# Altium schematic sheet WL-AUDIO.SchDoc
size 420 x 297 mm; Address1: Address1; Address2: Address2; Address3: Address3; Address4: Address4; DocumentNumber: ТРАНСИВЕР «ВОЛК»; SheetNumber: 6; Scale: 1:1; DocumentType: Схема электрическая принципиальная; FirstReferrence: АБВГ.123456.001
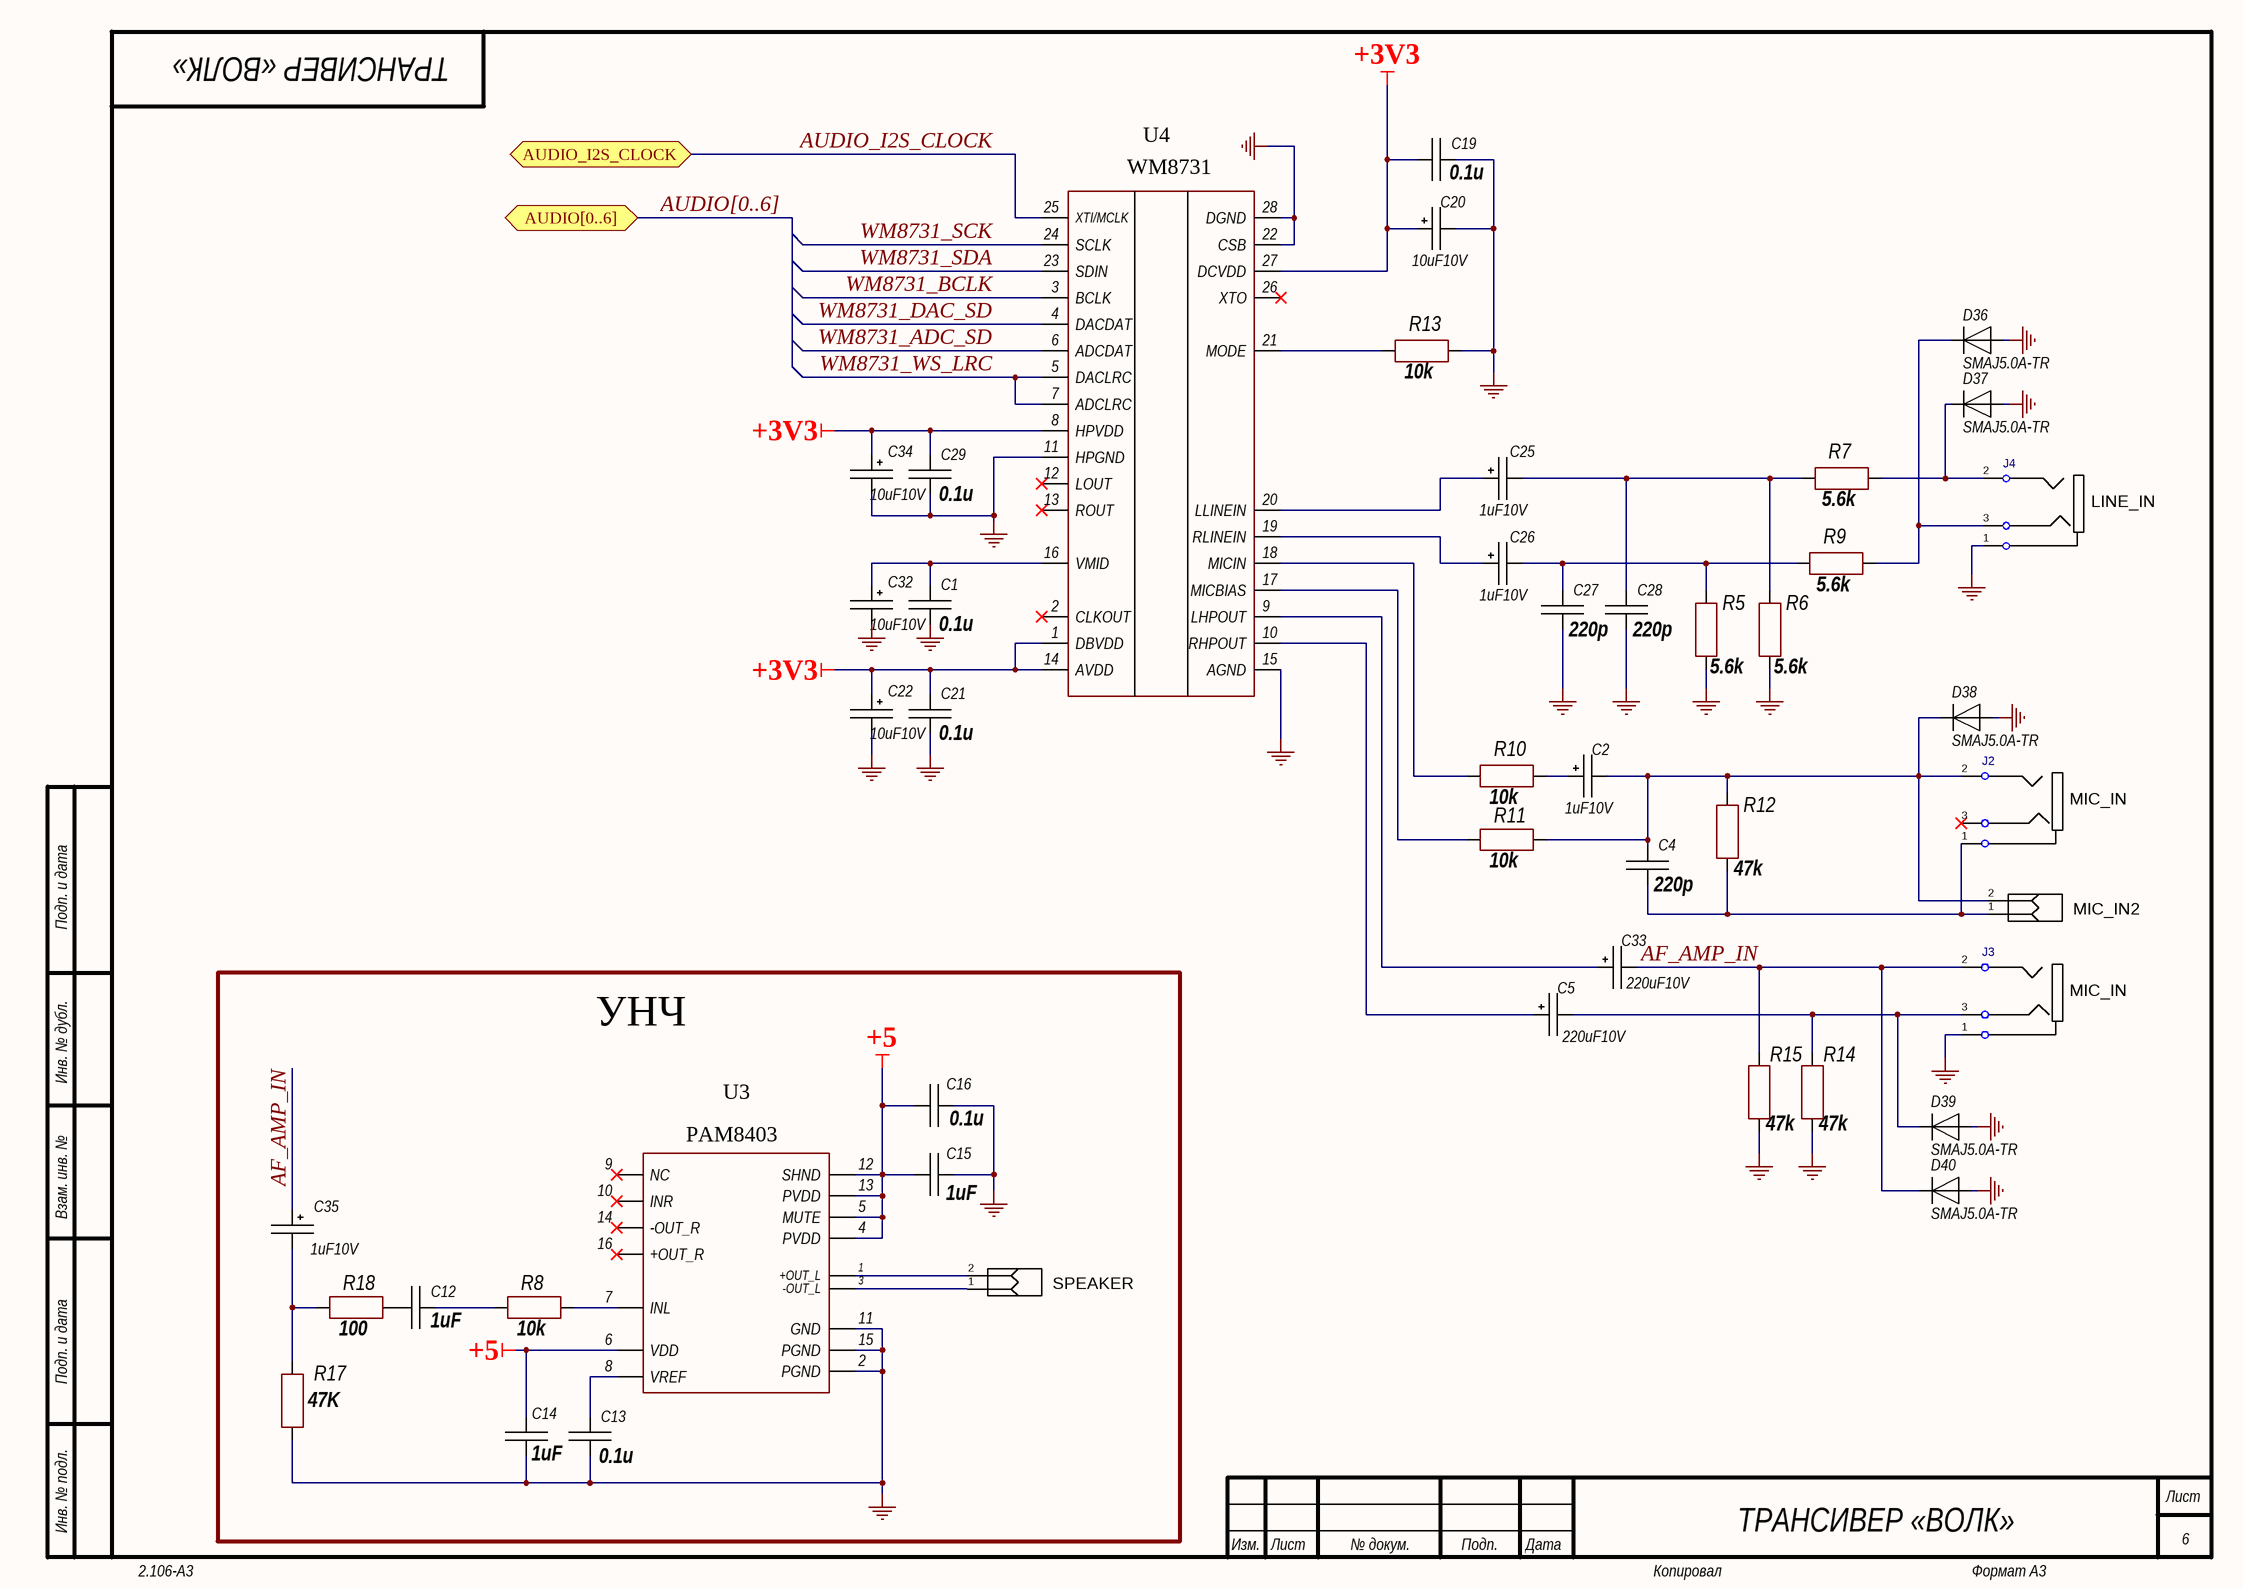
[diagram p0: WL-AUDIO.SchDoc]

## Parts
C1  0.1u  [CH0201C]
C2  1uF10V  [D5C2H11]
C4  220p  [CH0201C]
C5  220uF10V  [D5C2H11]
C12  1uF  [CH0201C]
C13  0.1u  [CH0805C]
C14  1uF  [CH0805C]
C15  1uF  [CH0805C]
C16  0.1u  [CH0805C]
C19  0.1u  [CH0201C]
C20  10uF10V  [D5C2H11]
C21  0.1u  [CH0201C]
C22  10uF10V  [D5C2H11]
C25  1uF10V  [D5C2H11]
C26  1uF10V  [D5C2H11]
C27  220p  [CH0201C]
C28  220p  [CH0201C]
C29  0.1u  [CH0201C]
C32  10uF10V  [D5C2H11]
C33  220uF10V  [D5C2H11]
C34  10uF10V  [D5C2H11]
C35  1uF10V  [D5C2H11]
D36  SMAJ5.0A-TR  [SOD123]
D37  SMAJ5.0A-TR  [SOD123]
D38  SMAJ5.0A-TR  [SOD123]
D39  SMAJ5.0A-TR  [SOD123]
D40  SMAJ5.0A-TR  [SOD123]
J2  value MIC_IN  [SJ1-3525NG]  (hidden comment: SJ1-3525NG)
J3  value MIC_IN  [SJ1-3525NG]  (hidden comment: SJ1-3525NG)
J4  value LINE_IN  [SJ1-3525NG]  (hidden comment: SJ1-3525NG)
MIС_IN2  MIС_IN2  [51022-0200]  (value not drawn)
R5  5.6k  [CH0805R]
R6  5.6k  [CH0805R]
R7  5.6k  [CH0805R]
R8  10k  [CH0805R]
R9  5.6k  [CH0805R]
R10  10k  [CH0805R]
R11  10k  [CH0805R]
R12  47k  [CH0805R]
R13  10k  [CH0805R]
R14  47k  [CH0805R]
R15  47k  [CH0805R]
R17  47K  [CH0805R]
R18  100  [CH0805R]
SPEAKER  MIС_IN2  [51022-0200]  (value not drawn)
U3  PAM8403  [16-SOP]
U4  WM8731  [28-SSOP]

## Blocks framed on the sheet
УНЧ: C12-C16 C35 R8 R17 R18 SPEAKER U3

## Ports
AUDIO[0..6] (bidir), AUDIO_I2S_CLOCK (bidir)

## Nets
+3V3: C19.1 C20.1 C21.2 C22.1 C29.2 C34.1 U4.1(DBVDD) U4.8(HPVDD) U4.14(AVDD) U4.27(DCVDD)
+5: C14.2 C15.2 C16.2 U3.4(PVDD) U3.5(MUTE) U3.6(VDD) U3.12(SHND) U3.13(PVDD)
GND: C1.1 C13.1 C14.1 C15.1 C16.1 C19.2 C20.2 C21.1 C22.2 C27.1 C28.1 C29.1 C32.2 C34.2 D36.1 D37.1 D38.1 D39.1 D40.1 J3.1(sleeve) J4.1(sleeve) R5.2 R6.2 R13.1 R14.2 R15.2 R17.2 U3.2(PGND) U3.11(GND) U3.15(PGND) U4.11(HPGND) U4.15(AGND) U4.22(CSB) U4.28(DGND)
AF_AMP_IN: C33.2 C35.1 D40.2 J3.2(tip) R15.1
AUDIO_I2S_CLOCK: U4.25(XTI/MCLK) ; port AUDIO_I2S_CLOCK
WM8731_ADC_SD: U4.6(ADCDAT)
WM8731_BCLK: U4.3(BCLK)
WM8731_DAC_SD: U4.4(DACDAT)
WM8731_SCK: U4.24(SCLK)
WM8731_SDA: U4.23(SDIN)
WM8731_WS_LRC: U4.5(DACLRC) U4.7(ADCLRC)
NetC1_2: C1.2 C32.1 U4.16(VMID)
NetC2_1: C2.1 R10.1
NetC2_2: C2.2 C4.2 D38.2 J2.2(tip) MIС_IN2.2 R11.1 R12.1
NetC4_1: C4.1 J2.1(sleeve) MIС_IN2.1 R12.2
NetC5_1: C5.1 U4.10(RHPOUT)
NetC5_2: C5.2 D39.2 J3.3(ring) R14.1
NetC12_1: C12.1 R18.1
NetC12_2: C12.2 R8.2
NetC13_2: C13.2 U3.8(VREF)
NetC25_1: C25.1 U4.20(LLINEIN)
NetC25_2: C25.2 C28.2 R6.1 R7.2
NetC26_1: C26.1 U4.19(RLINEIN)
NetC26_2: C26.2 C27.2 R5.1 R9.2
NetC33_1: C33.1 U4.9(LHPOUT)
NetC35_2: C35.2 R17.1 R18.2
NetD36_2: D36.2 J4.3(ring) R9.1
NetD37_2: D37.2 J4.2(tip) R7.1
NetR8_1: R8.1 U3.7(INL)
NetR10_2: R10.2 U4.18(MICIN)
NetR11_2: R11.2 U4.17(MICBIAS)
NetR13_2: R13.2 U4.21(MODE)
NetSPEAKER_1: SPEAKER.1 U3.3(-OUT_L)
NetSPEAKER_2: SPEAKER.2 U3.1(+OUT_L)

Not connected (* = marked no-connect by the designer): J2 3(ring)*; U3 9(NC)* 10(INR)* 14(-OUT_R)* 16(+OUT_R)*; U4 2(CLKOUT)* 12(LOUT)* 13(ROUT)* 26(XTO)*

## Buses and harness runs
bus AUDIO[0..6] = port AUDIO[0..6]

## Notes on the sheet
- Подп. и дата
- Инв. № дубл.
- Взам. инв. №
- Инв. № подл.
- Изм.
- Лист
- № докум.
- Подп.
- Дата
- 2.106-A3
- Копировал
- Формат А3

## Library data of the parts
C1 C4 C12-C16 C19 C21 C27-C29 = Capacitor: Manufacturer: *; Model: *; HelpURL: *; ComponentKind: *; Value: *
C2 C5 C20 C22 C25 C26 C32-C35 = AlumCap: Manufacturer: *; Model: *; HelpURL: *; ComponentKind: *; Value: *
D36-D40 = Diod: ComponentKind: *; Manufacturer: *; Model: *; HelpURL: *
J2-J4 = SJ1-3523N
MIС_IN2 SPEAKER = 51022-0200: 2 Pin
R5-R15 R17 R18 = Resistor: Manufacturer: *; Model: *; HelpURL: *; ComponentKind: *; Value: *